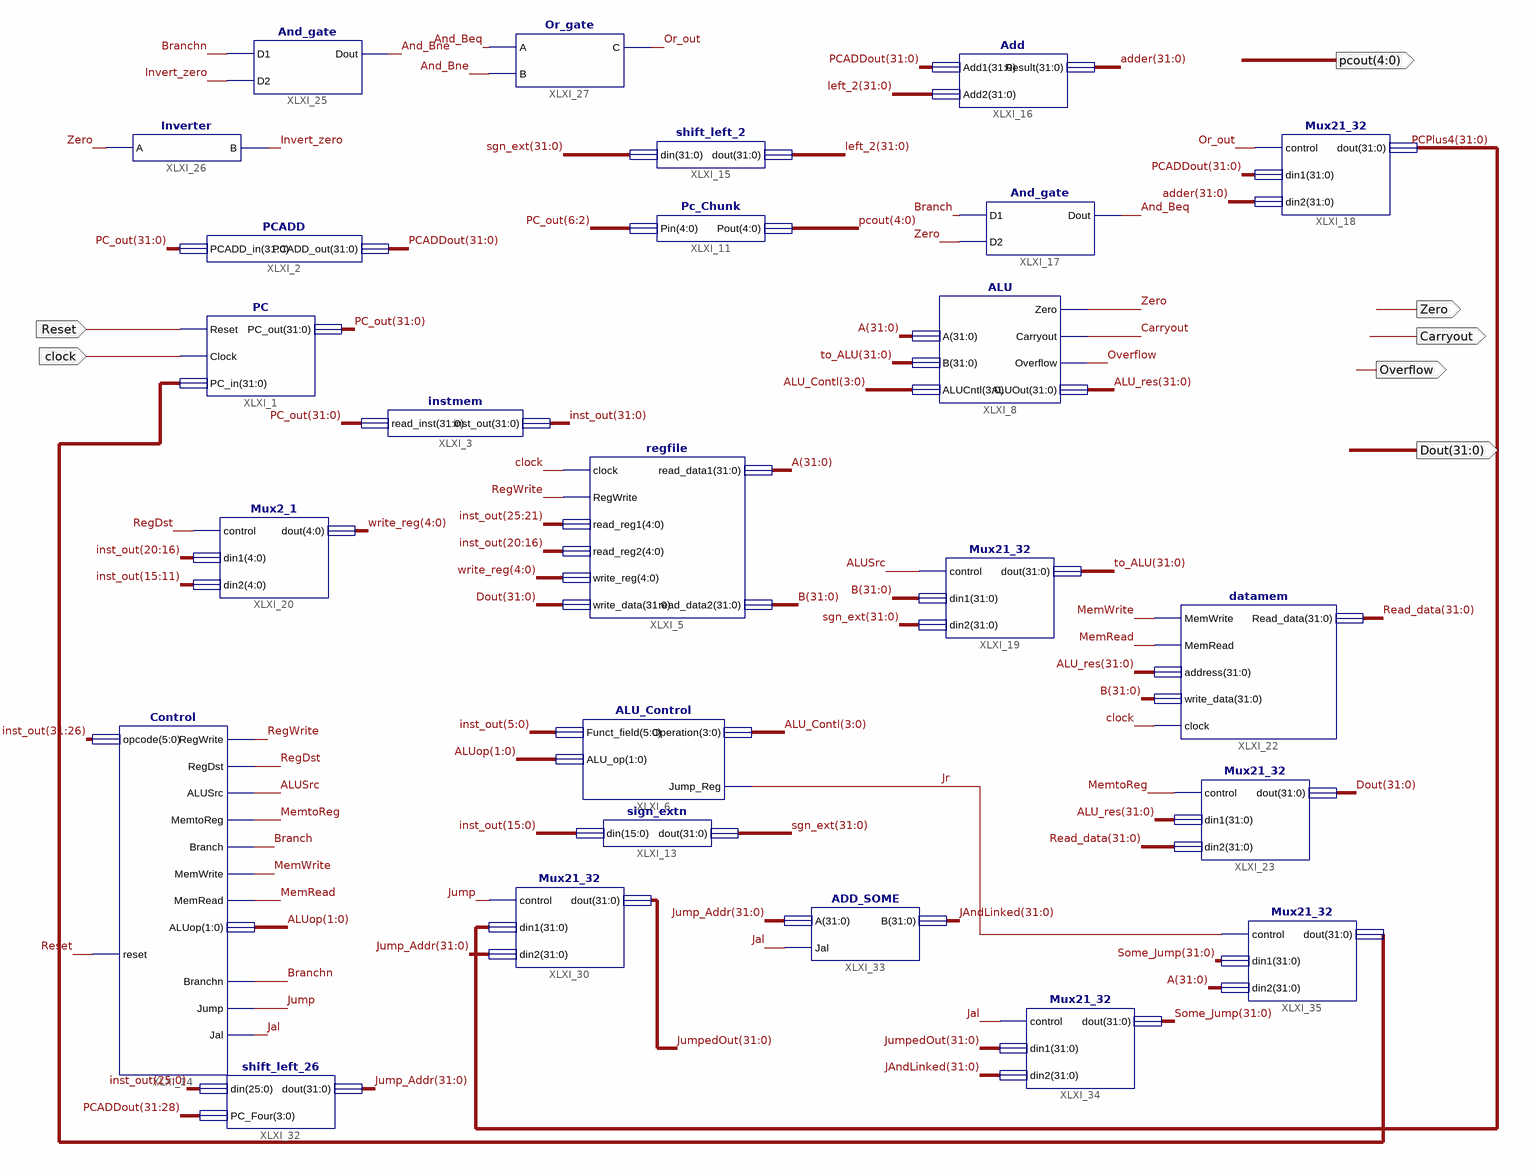
[diagram p0: schematic sheet 1]
// Xilinx ISE schematic Schem.sch (spartan3e) as structural Verilog: 25 symbols, 7 ports
module Schem (
  input  Reset,
  input  clock,
  output [31:0] Dout,
  output Overflow,
  output Zero,
  output Carryout,
  output [4:0] pcout
);

  wire ALUSrc, And_Beq, And_Bne, Branch, Branchn, Invert_zero, Jal, Jr, Jump, MemRead, MemtoReg, MemWrite,
       Or_out, RegDst, RegWrite;
  wire [1:0] ALUop;
  wire [3:0] ALU_Contl;
  wire [4:0] write_reg;
  wire [31:0] A, adder, ALU_res, B, inst_out, JAndLinked, Jump_Addr, JumpedOut, left_2, PC_out, PCADDout,
       PCPlus4, Read_data, sgn_ext, Some_Jump, to_ALU, XLXN_13;

  PC XLXI_1 (.Reset(Reset), .Clock(clock), .PC_in(XLXN_13), .PC_out(PC_out));
  PCADD XLXI_2 (.PCADD_in(PC_out), .PCADD_out(PCADDout));
  instmem XLXI_3 (.read_inst(PC_out), .inst_out(inst_out));
  regfile XLXI_5 (
    .clock(clock), .RegWrite(RegWrite), .read_reg1(inst_out[25:21]), .read_reg2(inst_out[20:16]),
    .write_reg(write_reg), .write_data(Dout), .read_data1(A), .read_data2(B));
  ALU_Control XLXI_6 (.ALU_op(ALUop), .Funct_field(inst_out[5:0]), .Operation(ALU_Contl), .Jump_Reg(Jr));
  ALU XLXI_8 (
    .A(A), .B(to_ALU), .ALUCntl(ALU_Contl), .Zero(Zero), .Carryout(Carryout), .Overflow(Overflow),
    .ALUOut(ALU_res));
  Pc_Chunk XLXI_11 (.Pin(PC_out[6:2]), .Pout(pcout));
  sign_extn XLXI_13 (.din(inst_out[15:0]), .dout(sgn_ext));
  Control XLXI_14 (
    .reset(Reset), .opcode(inst_out[31:26]), .RegWrite(RegWrite), .RegDst(RegDst), .ALUSrc(ALUSrc),
    .MemtoReg(MemtoReg), .Branch(Branch), .MemWrite(MemWrite), .MemRead(MemRead), .Branchn(Branchn),
    .Jump(Jump), .ALUop(ALUop), .Jal(Jal));
  shift_left_2 XLXI_15 (.din(sgn_ext), .dout(left_2));
  Add XLXI_16 (.Add1(PCADDout), .Add2(left_2), .Result(adder));
  And_gate XLXI_17 (.D1(Branch), .D2(Zero), .Dout(And_Beq));
  Mux21_32 XLXI_18 (.control(Or_out), .din1(PCADDout), .din2(adder), .dout(PCPlus4));
  Mux21_32 XLXI_19 (.control(ALUSrc), .din1(B), .din2(sgn_ext), .dout(to_ALU));
  Mux2_1 XLXI_20 (.control(RegDst), .din1(inst_out[20:16]), .din2(inst_out[15:11]), .dout(write_reg));
  datamem XLXI_22 (
    .MemWrite(MemWrite), .MemRead(MemRead), .address(ALU_res), .write_data(B), .Read_data(Read_data),
    .clock(clock));
  Mux21_32 XLXI_23 (.control(MemtoReg), .din1(ALU_res), .din2(Read_data), .dout(Dout));
  And_gate XLXI_25 (.D1(Branchn), .D2(Invert_zero), .Dout(And_Bne));
  Inverter XLXI_26 (.A(Zero), .B(Invert_zero));
  Or_gate XLXI_27 (.A(And_Beq), .B(And_Bne), .C(Or_out));
  Mux21_32 XLXI_30 (.control(Jump), .din1(PCPlus4), .din2(Jump_Addr), .dout(JumpedOut));
  shift_left_26 XLXI_32 (.din(inst_out[25:0]), .PC_Four(PCADDout[31:28]), .dout(Jump_Addr));
  ADD_SOME XLXI_33 (.A(Jump_Addr), .B(JAndLinked), .Jal(Jal));
  Mux21_32 XLXI_34 (.control(Jal), .din1(JumpedOut), .din2(JAndLinked), .dout(Some_Jump));
  Mux21_32 XLXI_35 (.control(Jr), .din1(Some_Jump), .din2(A), .dout(XLXN_13));
endmodule
